# EasyEDA Pro project GIM8108-8伺泰威无刷电机.epro, schematic Schematic1
Board Name: Board1; Create Date: 2025-12-02; Page Name: P1; Project Name: FOC第三版-大电流; Schematic Name: Schematic1; Update Date: 2025-12-10; BladeWidth: 10; Company: 嘉立创EDA; Page Size: A4; RegionStart: 1; ShowBorder: 1; TitleBlock: 1; TitleBlockPosition: 3; Version: V1.0; XRegionCount: 6; YRegionCount: 4
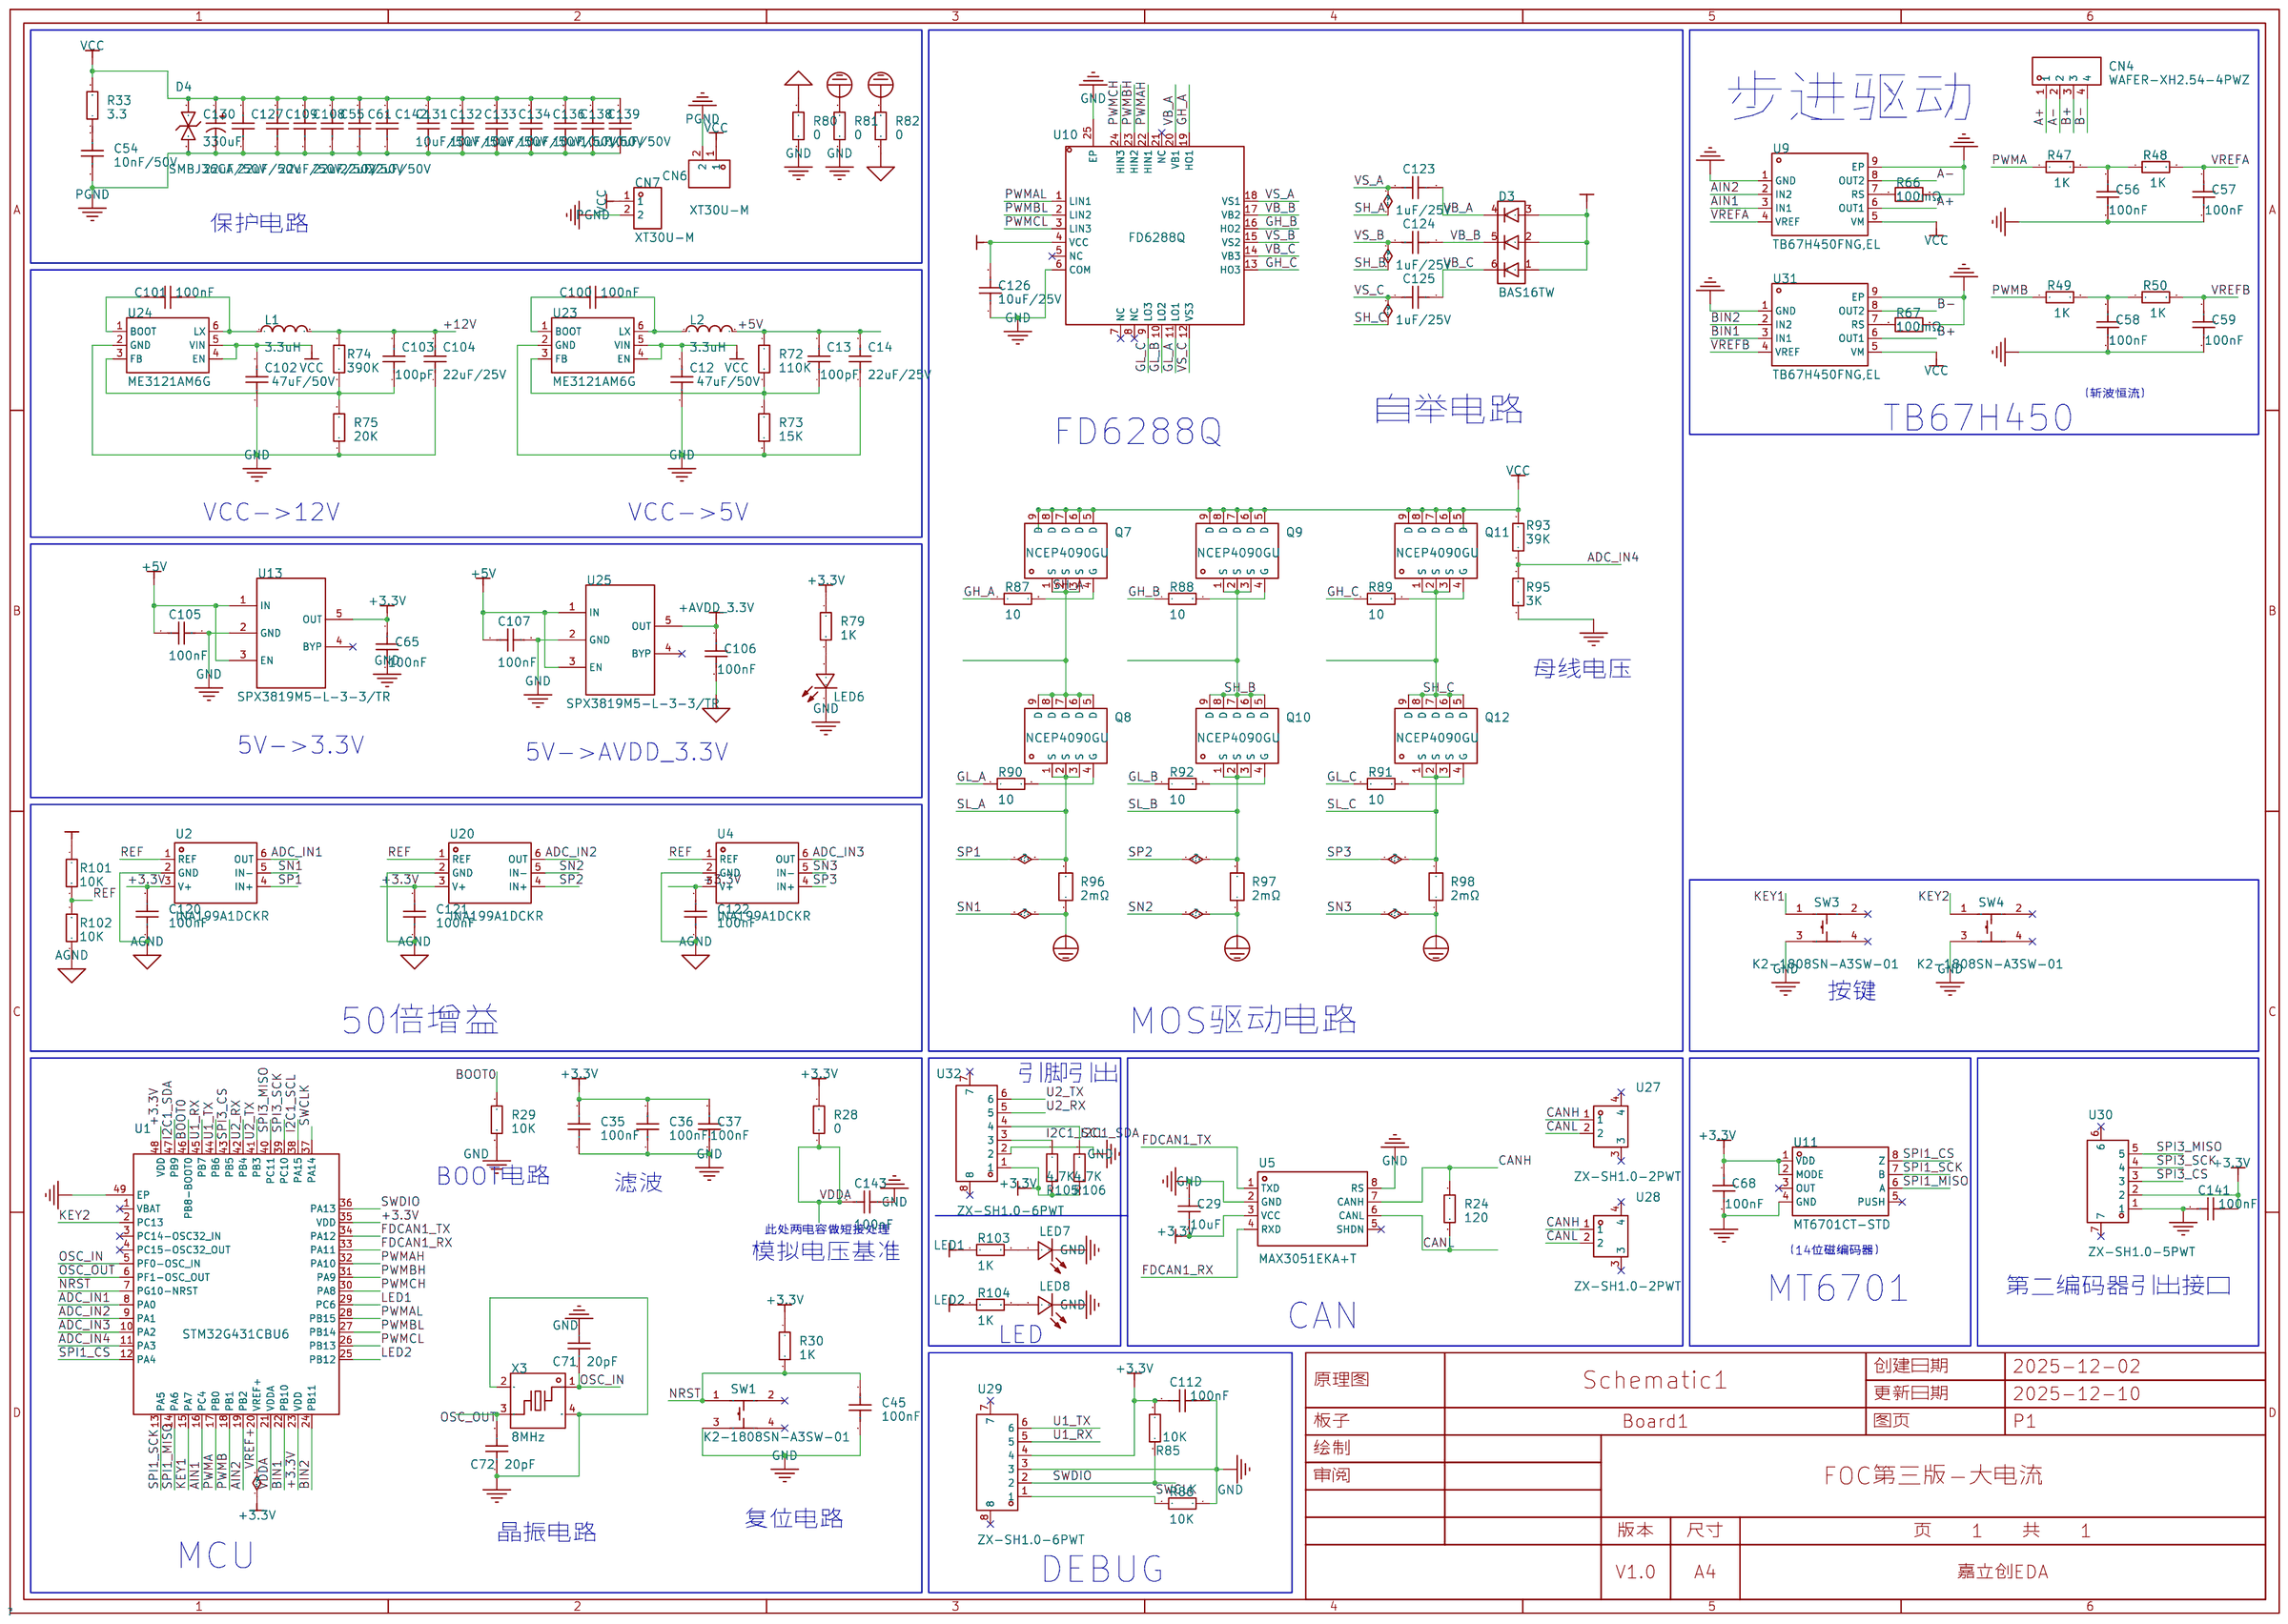
[diagram p0: schematic sheet]

## Parts
C12  47uF/50V  [C1206]
C13  100pF  [C0603]
C14  22uF/25V  [C0805]
C29  10uF  [C0603]
C35  100nF  [C0603]
C36  100nF  [C0603]
C37  100nF  [C0603]
C45  100nF  [C0603]
C54  10nF/50V  [C0603]
C55  22uF/50V  [C1206]
C56  100nF  [C0603]
C57  100nF  [C0603]
C58  100nF  [C0603]
C59  100nF  [C0603]
C61  22uF/50V  [C1206]
C65  100nF  [C0603]
C68  100nF  [C0603]
C71  20pF  [C0603]
C72  20pF  [C0603]
C100  100nF  [C0603]
C101  100nF  [C0603]
C102  47uF/50V  [C1206]
C103  100pF  [C0603]
C104  22uF/25V  [C0805]
C105  100nF  [C0603]
C106  100nF  [C0603]
C107  100nF  [C0603]
C108  22uF/50V  [C1206]
C109  22uF/50V  [C1206]
C112  100nF  [C0603]
C120  100nF  [C0603]
C121  100nF  [C0603]
C122  100nF  [C0603]
C123  1uF/25V  [C0603]
C124  1uF/25V  [C0603]
C125  1uF/25V  [C0603]
C126  10uF/25V  [C0603]
C127  22uF/50V  [C1206]
C130  330uF  [CAP-SMD_BD10.0-L10.3-W10.3-FD-LS11.0]
C131  10uF/50V  [C0805]
C132  10uF/50V  [C0805]
C133  10uF/50V  [C0805]
C134  10uF/50V  [C0805]
C136  10uF/50V  [C0805]
C138  10uF/50V  [C0805]
C139  10uF/50V  [C0805]
C141  100nF  [C0603]
C142  22uF/50V  [C1206]
C143  100nF  [C0603]
CN4  WAFER-XH2.54-4PWZ  [CONN-TH_4P-P2.50_WAFER-XH2.54-4PWZ]
CN6  XT30U-M  [CONN-TH_XT30U-M]
CN7  XT30U-M  [CONN-TH_XT30U-M]
D3  BAS16TW  [SOT-363_L2.1-W1.3-P0.65-LS2.3-BL]
D4  SMBJ36CA  [SMB_L4.4-W3.6-LS5.3-BI]
L1  3.3uH  [IND-SMD_L3.8-W3.8_GCRH3D16-XX]
L2  3.3uH  [IND-SMD_L3.8-W3.8_GCRH3D16-XX]
LED6  KT-0603R  [LED0603-RD]
LED7  KT-0603R  [LED0603-RD]
LED8  KT-0603R  [LED0603-RD]
Q7  NCEP4090GU  [PDFN-8_L5.8-W5.1-P1.27-LS6.1-BL]
Q8  NCEP4090GU  [PDFN-8_L5.8-W5.1-P1.27-LS6.1-BL]
Q9  NCEP4090GU  [PDFN-8_L5.8-W5.1-P1.27-LS6.1-BL]
Q10  NCEP4090GU  [PDFN-8_L5.8-W5.1-P1.27-LS6.1-BL]
Q11  NCEP4090GU  [PDFN-8_L5.8-W5.1-P1.27-LS6.1-BL]
Q12  NCEP4090GU  [PDFN-8_L5.8-W5.1-P1.27-LS6.1-BL]
R24  120  [R0603]
R28  0  [R0603]
R29  10K  [R0603]
R30  1K  [R0603]
R33  3.3  [R0603]
R47  1K  [R0603]
R48  1K  [R0603]
R49  1K  [R0603]
R50  1K  [R0603]
R66  100mΩ  [RES-SMD_L6.4-W3.2-R2512]
R67  100mΩ  [RES-SMD_L6.4-W3.2-R2512]
R72  110K  [R0603]
R73  15K  [R0603]
R74  390K  [R0603]
R75  20K  [R0603]
R79  1K  [R0603]
R80  0  [R0603]
R81  0  [R0603]
R82  0  [R0603]
R85  10K  [R0603]
R86  10K  [R0603]
R87  10  [R0603]
R88  10  [R0603]
R89  10  [R0603]
R90  10  [R0603]
R91  10  [R0603]
R92  10  [R0603]
R93  39K  [R0603]
R95  3K  [R0603]
R96  2mΩ  [R1206]
R97  2mΩ  [R1206]
R98  2mΩ  [R1206]
R101  10K  [R0603]
R102  10K  [R0603]
R103  1K  [R0603]
R104  1K  [R0603]
R105  4.7K  [R0603]
R106  4.7K  [R0603]
SW1  K2-1808SN-A3SW-01  [SW-SMD_4P-L4.2-W3.3-P2.15-LS5.1]
SW3  K2-1808SN-A3SW-01  [SW-SMD_4P-L4.2-W3.3-P2.15-LS5.1]
SW4  K2-1808SN-A3SW-01  [SW-SMD_4P-L4.2-W3.3-P2.15-LS5.1]
U1  STM32G431CBU6  [VQFN-48_L7.0-W7.0-P0.50-BL-EP5.5]
U2  INA199A1DCKR  [SC-70-6_L2.2-W1.3-P0.65-LS2.1-BR]
U4  INA199A1DCKR  [SC-70-6_L2.2-W1.3-P0.65-LS2.1-BR]
U5  MAX3051EKA+T  [SOT-23-8_L3.0-W1.7-P0.65-LS2.8-TL]
U9  TB67H450FNG,EL  [HSOP-8_L5.0-W4.0-P1.27-LS6.2-BL-EP]
U10  FD6288Q  [QFN-24_L4.0-W4.0-P0.50-BL-EP2.6]
U11  MT6701CT-STD  [SOP-8_L4.9-W3.9-P1.27-LS6.0-BL]
U13  SPX3819M5-L-3-3/TR  [SOT-23-5_L3.0-W1.7-P0.95-LS2.8-BL]
U20  INA199A1DCKR  [SC-70-6_L2.2-W1.3-P0.65-LS2.1-BR]
U23  ME3121AM6G  [SOT-23-6_L2.9-W1.6-P0.95-LS2.8-BR]
U24  ME3121AM6G  [SOT-23-6_L2.9-W1.6-P0.95-LS2.8-BR]
U25  SPX3819M5-L-3-3/TR  [SOT-23-5_L3.0-W1.7-P0.95-LS2.8-BL]
U27  ZX-SH1.0-2PWT  [CONN-SMD_2P-P1.00_HX-1.0-2P-WT]
U28  ZX-SH1.0-2PWT  [CONN-SMD_2P-P1.00_HX-1.0-2P-WT]
U29  ZX-SH1.0-6PWT  [CONN-SMD_6P-P1.00_MEGASTAR_ZX-SH1.0-6PWT]
U30  ZX-SH1.0-5PWT  [CONN-SMD_5P-P1.00_MEGASTAR_ZX-SH1.0-5PWT]
U31  TB67H450FNG,EL  [HSOP-8_L5.0-W4.0-P1.27-LS6.2-BL-EP]
U32  ZX-SH1.0-6PWT  [CONN-SMD_6P-P1.00_MEGASTAR_ZX-SH1.0-6PWT]
X3  8MHz  [CRYSTAL-SMD_4P-L3.2-W2.5-BL]

## Library data of the parts
C12 C55 C61 C102 C108 C109 C127 C142 = CAP_1206: Supplier Footprint: 1206
C13 C29 C35-C37 C45 C54 C56-C59 C65 C68 C71 C72 C100 C101 C103 C105-C107 C112 C120-C126 C141 C143 = CAP_0603: Supplier Footprint: 0603
C14 C104 C131-C134 C136 C138 C139 = CAP_0805: Supplier Footprint: 0805
C130 = JVJ50V330M10x10: 容值:330uF;精度:±20%;额定电压:50V;纹波电流:220mA@120Hz;; LCSC Part Name: 330uF ±20% 50V; Supplier Part: C46550419; Manufacturer: JIERR(捷而瑞); Supplier Footprint: SMD,D10xL10.5mm; Datasheet: https://item.szlcsc.com/datasheet/JVJ50V330M10x10/48680113.html; Supplier: LCSC; Tolerance: ±20%; Voltage Rating: 50V; Ripple Current: 220mA@120Hz; Diameter: 10mm; Height - Seated (Max): 10.5mm; Lifetime: 2000hrs@105℃; Operating Temperature: -55℃~+105℃
CN4 = WAFER-XH2.54-4PWZ: 插针结构:1x4P;间距:2.54mm;安装方式:弯插;总PIN数:4P;排数:1;每排PIN数:4;额定电流:2A;工作温度范围:-25℃~+85℃;; LCSC Part Name: XH 2.54mm 1x4P 弯插; Supplier Part: C5359641; Manufacturer: XUNPU(讯普); Supplier Footprint: 弯插,P=2.5mm; JLCPCB Part Class: 扩展库; Datasheet: https://atta.szlcsc.com/upload/public/pdf/source/20230221/397FB6E0B838EFC6EA17AAEABEF58A8D.pdf; Supplier: LCSC; Pins Structure: 1x4P; Pitch: 2.54mm; Mounting Style: 弯插; Number of Pins: 4P; Number of Rows: 1; Number of PINs Per Row: 4; Current Rating (Max): 2A; Operating Temperature Range: -25℃~+85℃
CN6 CN7 = XT30U-M: 类别:-;类型1:-;; LCSC Part Name: AMASS(艾迈斯)轻量版锂电池插头公头 XT30U-M; Supplier Part: C99101; Manufacturer: AMASS(艾迈斯); Datasheet: https://item.szlcsc.com/datasheet/XT30U-M/100314.html; Supplier: LCSC; Type: 插头; Colour: 黄色; InterfaceType: 公头
D3 = BAS16TW: 二极管配置:3个独立式;正向压降(Vf):1.25V@150mA;直流反向耐压(Vr):75V;整流电流:150mA;反向恢复时间(trr):4ns;; LCSC Part Name: 电压:75V 电流:150mA; Supplier Part: C68955; Manufacturer: CJ(江苏长电/长晶); Supplier Footprint: SOT-363; JLCPCB Part Class: 扩展库; Datasheet: https://atta.szlcsc.com/upload/public/pdf/source/20160516/1463363918721.pdf; Supplier: LCSC; Diode Configuration: 3个独立式; Forward Voltage (Vf@If): 1.25V@150mA; Reverse Voltage (Vr): 75V; Rectified Current: 150mA; Reverse Leakage Current: 1uA@75V; Reverse Recovery Time (trr): 4ns
D4 = SMBJ36CA_C726875: 极性：双向 反向截止电压(Vrwm)：36V 击穿电压：40V 最大钳位电压：58.1V; Supplier Part: C726875; Manufacturer: TWGMC(台湾迪嘉); Supplier Footprint: SMB; JLCPCB Part Class: 扩展库; Datasheet: https://atta.szlcsc.com/upload/public/pdf/source/20200901/C726811_07201DC3516E92FF13903A0BAE18F725.pdf; Supplier: LCSC
L1 L2 = YPRH3D16-3R3M: 电感值:3.3uH;精度:±20%;额定电流:1.1A;; LCSC Part Name: 3.3uH ±20%; Supplier Part: C514833; Manufacturer: YJYCOIN(益嘉源); Supplier Footprint: SMD,3.8x3.8x1.8mm; JLCPCB Part Class: 扩展库; Datasheet: https://atta.szlcsc.com/upload/public/pdf/source/20200415/C514834_534F0539B05F5AD94685E0BB7E05C791.pdf; Supplier: LCSC; Tolerance: ±20%; Rated Current: 1.1A; DC Resistance (DCR): 85mΩ
LED6-LED8 = KT-0603R: 发光颜色:红色;功率:-;正向电流:-;主波长:-;二极管配置:-;透镜颜色:-;色温:-;发光角度:-;载带方式:-;工作温度:-40℃~+85℃;; LCSC Part Name: 0603 红灯 高亮; Supplier Part: C2286; Manufacturer: KENTO; Supplier Footprint: 0603; JLCPCB Part Class: 基础库; Datasheet: https://atta.szlcsc.com/upload/public/pdf/source/20160616/1466072038404.pdf; Supplier: LCSC; Emitted Color: 红色; Operating Temperature: -40℃~+85℃
Q7-Q12 = NCEP4090GU: 类型:1个N沟道;漏源电压(Vdss):40V;连续漏极电流(Id):90A;导通电阻(RDS(on)@Vgs,Id):2.2mΩ@10V,20A;功率:34W;阈值电压(Vgs(th)@Id):1.5V@250uA;; LCSC Part Name: 1个N沟道 耐压:40V 电流:90A; Supplier Part: C502976; Manufacturer: NCE(无锡新洁能); Supplier Footprint: PDFN-8(5.1x5.8); JLCPCB Part Class: 扩展库; Datasheet: https://atta.szlcsc.com/upload/public/pdf/source/20220527/503A5DACCB80AF3F7DC57D53F14F52A5.pdf; Supplier: LCSC; Type: 1个N沟道; Drain Source Voltage (Vdss): 40V; Continuous Drain Current (Id): 90A; Drain Source On Resistance (RDS(on)@Vgs,Id): 2.2mΩ@10V,20A; Power Dissipation (Pd): 34W; Gate Threshold Voltage (Vgs(th)@Id): 1.5V@250uA; Total Gate Charge (Qg@Vgs): 40nC@20V; Input Capacitance (Ciss@Vds): 2.3nF@20V; Reverse Transfer Capacitance (Crss@Vds): 38pF; Operating Temperature: -55℃~+150℃
R24 R28-R30 R33 R47-R50 R72-R75 R79-R82 R85-R93 R95 R101-R106 = Res_0603: Supplier Footprint: 0603
R66 R67 = HoJLR2512-3W-100mR-1%: 电阻类型:采样电阻;阻值:100mΩ;精度:±1%;功率:3W;安装方式:贴片;; LCSC Part Name: 100mΩ ±1% 3W; Supplier Part: C2903476; Manufacturer: Milliohm(毫欧); Supplier Footprint: 2512; JLCPCB Part Class: 扩展库; Datasheet: https://atta.szlcsc.com/upload/public/pdf/source/20211009/7525CABAB363C979E942C1DD41F1FEF0.pdf; Supplier: LCSC; Type: 采样电阻; Tolerance: ±1%; Power(Watts): 3W; Mounting Sytle: 贴片
R96-R98 = HoJLR1206-1W-2mR-1%: 电阻类型:采样电阻;阻值:2mΩ;精度:±1%;功率:1W;安装方式:贴片;; LCSC Part Name: 2mΩ ±1% 1W; Supplier Part: C2904210; Manufacturer: Milliohm(毫欧); Supplier Footprint: 1206; JLCPCB Part Class: 扩展库; Datasheet: https://atta.szlcsc.com/upload/public/pdf/source/20211122/59F6674D1588D46FBBACD90BE2B15C8F.pdf; Supplier: LCSC; Type: 采样电阻; Tolerance: ±1%; Power(Watts): 1W; Mounting Type: 贴片
SW1 SW3 SW4 = K2-1808SN-A3SW-01: 触点电流:50mA;额定电压(DC):12V;绝缘电阻:100MΩ;安装方式:立贴;作用力:180gf@±30gf;机械寿命:100000;工作温度:-25℃~+85℃;开关长度:4.2mm;开关宽度:3.25mm;开关高度:2.5mm;; LCSC Part Name: 3*4*2.5 贴片开关180G; Supplier Part: C2690012; Manufacturer: 韩国韩荣; Supplier Footprint: SMD; JLCPCB Part Class: 扩展库; Datasheet: https://atta.szlcsc.com/upload/public/pdf/source/20180927/C283535_7E7907F3E7B6C1691E1DC87E363D082A.pdf; Supplier: LCSC; Contact Current: 50mA; Voltage Rating (DC): 12V; Insulation Resistance: 100MΩ; Mounting Sytle: 立贴; Operating Force: 180gf@±30gf; Mechanical Life: 100000; Operating Temperature: -25℃~+85℃; Switch Length: 4.2mm; Switch Width: 3.25mm; Switch Height: 2.5mm
U1 = STM32G431CBU6: CPU内核:ARM-M系列;CPU最大主频:170MHz;应用领域:-;; LCSC Part Name: 带DSP和FPU的170MHz主流ARM Cortex-M4 MCU，具有128 KB Flash存储器、数学加速器和中等模拟电平集成; Supplier Part: C529356; Manufacturer: ST(意法半导体); Supplier Footprint: UFQFPN-48(7x7); JLCPCB Part Class: 扩展库; Datasheet: https://atta.szlcsc.com/upload/public/pdf/source/20200511/C529354_7C66CF00837B904D0C15DCE45B69418C.pdf; Supplier: LCSC; CPU Core: ARM-M系列; CPU Maximum Speed: 170MHz; Program Storage Size: 128KB; Program Memory Type: FLASH; Number of I/O: 42; ADC (Bit): 12bit; DAC (Bit): 12bit; Low Voltage Detection Threshold: 1.71V~3.6V
U2 U4 U20 = INA199A1DCKR: INA199 26V、双向电流感应放大器; Supplier Part: C59135; Manufacturer: TI(德州仪器); Supplier Footprint: SOT-363(SC-70-6); JLCPCB Part Class: 扩展库; Datasheet: https://www.ti.com/cn/lit/gpn/ina199; Supplier: LCSC; Supply Voltage: -300mV~26V; Supply Current: 300uA; Operating Temperature: -40℃~+125℃
U5 = MAX3051EKA+T: 类型:收发器;数据速率:1Mbps;; LCSC Part Name: 1Mbps 3.14V~3.47V; Supplier Part: C112005; Manufacturer: ADI(亚德诺); Supplier Footprint: SOT-23-8; JLCPCB Part Class: 扩展库; Datasheet: https://atta.szlcsc.com/upload/public/pdf/source/20171014/C112005_15079752662991037925.pdf; Supplier: LCSC; Type: 收发器; Data Rate: 1Mbps; Supply Voltage: 3.14V~3.47V
U9 U31 = TB67H450FNG,EL: Supplier Part: C545417; Manufacturer: TOSHIBA(东芝); Supplier Footprint: SOIC-8; JLCPCB Part Class: 扩展库; Datasheet: https://atta.szlcsc.com/upload/public/pdf/source/20211227/C3DC112555A020FEF41243C8668D1DC3.pdf; Supplier: LCSC
U10 = FD6288Q: Supplier Part: C328453; Manufacturer: Fortior Tech(峰岹); Supplier Footprint: QFN-24-EP(4x4); JLCPCB Part Class: 扩展库; Datasheet: https://atta.szlcsc.com/upload/public/pdf/source/20241101/0E2856EB301EAFFED732065FB088D773.pdf; Supplier: LCSC
U11 = MT6701CT-STD_C5451785: Supplier Part: C5451785; Manufacturer: MagnTek(麦歌恩); Supplier Footprint: SOP-8; JLCPCB Part Class: 扩展库; Datasheet: https://atta.szlcsc.com/upload/public/pdf/source/20240409/995E18415A669787D9A549675AADF1FD.pdf; Supplier: LCSC
U13 U25 = SPX3819M5-L-3-3/TR: 输出类型:固定;最大输入电压:16V;输出电压:3.3V;最大输出电流:500mA;电源纹波抑制比(PSRR):70dB;输出极性:正极;; LCSC Part Name: 输入16V 输出3.3V 500mA; Supplier Part: C9055; Manufacturer: MaxLinear(迈凌); Supplier Footprint: SOT-23-5; JLCPCB Part Class: 扩展库; Datasheet: https://atta.szlcsc.com/upload/public/pdf/source/20150720/1457707331934.pdf; Supplier: LCSC; Output Type: 固定; Maximum Input Voltage: 16V; Output Voltage: 3.3V; MAX Output Current: 500mA; Power Supply Rejection Ratio (PSRR): 70dB; Dropout Voltage: 700mV@(500mA); standby current: 8uA; Operating Temperature: -40℃~+125℃; Output Polarity: 正极; Number of Outputs: 1
U23 U24 = ME3121AM6G: 功能类型:降压型;输出类型:可调;工作电压:4.7V~40V;输出电压:-;输出电流:-;; LCSC Part Name: 40V输入1A负载同步整流降压DC-DC转换器; Supplier Part: C2932938; Manufacturer: MICRONE(南京微盟); Supplier Footprint: SOT-23-6; JLCPCB Part Class: 扩展库; Datasheet: https://atta.szlcsc.com/upload/public/pdf/source/20220331/EB46EBF6ED46F90696A7B4CB82ED1A1E.pdf; Supplier: LCSC; Function: 降压型; Output Type: 可调; Voltage - Supply: 4.7V~40V; Frequency - Switching: 1MHz; Operating Temperature: -40℃~+85℃; Synchronous Rectifier: 是; Number of Outputs: 1; Topology: 降压式; Quiescent Current: 120uA; Switch tube (built-in/external): 内置
U27 U28 = ZX-SH1.0-2PWT: 插针结构:1x2P;间距:1mm;安装方式:卧贴;参考系列:SH;总PIN数:2P;排数:1;每排PIN数:2;行距:-;额定电流:1A;触头材质:黄铜;触头镀层:锡;工作温度:-;; LCSC Part Name: 1x2P 间距:1mm 卧贴 系列:SH; Supplier Part: C7430444; Manufacturer: Megastar(兆星); Supplier Footprint: SMD,P=1mm,卧贴; JLCPCB Part Class: 扩展库; Datasheet: https://item.szlcsc.com/datasheet/ZX-SH1.0-2PWT/8430313.html; Supplier: LCSC; Pins Structure: 1x2P; Pitch: 1mm; Mounting Type: 卧贴; Reference Series: SH; Number of Pins: 2P; Number of Rows: 1; Number of PINs Per Row: 2; Current Rating: 1A; Contact Material: 黄铜; Contact Plating: 锡; Supplementary Features: 辅助焊脚; Color: 米色; Z-Height of the Board: 3.15mm; X-Length of Bottom Edge on Board (Spacing Line): 4.35mm; Y-Width of Bottom Edge on Board: 5.05mm
U29 U32 = ZX-SH1.0-6PWT: 插针结构:1x6P;间距:1mm;安装方式:卧贴;参考系列:SH;总PIN数:6P;排数:1;每排PIN数:6;行距:-;额定电流:1A;触头材质:黄铜;触头镀层:锡;工作温度:-;; LCSC Part Name: 1x6P 间距:1mm 卧贴 系列:SH; Supplier Part: C7430448; Manufacturer: Megastar(兆星); Supplier Footprint: SMD,P=1mm,卧贴; JLCPCB Part Class: 扩展库; Datasheet: https://item.szlcsc.com/datasheet/ZX-SH1.0-6PWT/8430317.html; Supplier: LCSC; Pins Structure: 1x6P; Pitch: 1mm; Mounting Type: 卧贴; Reference Series: SH; Number of Pins: 6P; Number of Rows: 1; Number of PINs Per Row: 6; Current Rating: 1A; Contact Material: 黄铜; Contact Plating: 锡; Supplementary Features: 辅助焊脚; Color: 米色; Z-Height of the Board: 3.15mm; X-Length of Bottom Edge on Board (Spacing Line): 8.35mm; Y-Width of Bottom Edge on Board: 5.05mm
U30 = ZX-SH1.0-5PWT: 插针结构:1x5P;间距:1mm;安装方式:卧贴;参考系列:SH;总PIN数:5P;排数:1;每排PIN数:5;行距:-;额定电流:1A;触头材质:黄铜;触头镀层:锡;工作温度:-;; LCSC Part Name: 1x5P 间距:1mm 卧贴 系列:SH; Supplier Part: C7430447; Manufacturer: Megastar(兆星); Supplier Footprint: SMD,P=1mm,卧贴; JLCPCB Part Class: 扩展库; Datasheet: https://item.szlcsc.com/datasheet/ZX-SH1.0-5PWT/8430316.html; Supplier: LCSC; Pins Structure: 1x5P; Pitch: 1mm; Mounting Type: 卧贴; Reference Series: SH; Number of Pins: 5P; Number of Rows: 1; Number of PINs Per Row: 5; Current Rating: 1A; Contact Material: 黄铜; Contact Plating: 锡; Supplementary Features: 辅助焊脚; Color: 米色; Z-Height of the Board: 3.15mm; X-Length of Bottom Edge on Board (Spacing Line): 7.35mm; Y-Width of Bottom Edge on Board: 5.05mm
X3 = X32258MSB4SI: 晶振类型:贴片晶振;频率:8MHz;常温频差:±10ppm;外接负载电容:20pF;频率稳定度(全温):±20ppm;; LCSC Part Name: 8MHz ±10ppm 20pF; Supplier Part: C2682774; Manufacturer: YXC(扬兴晶振); Supplier Footprint: SMD3225-4P; JLCPCB Part Class: 扩展库; Datasheet: https://atta.szlcsc.com/upload/public/pdf/source/20240329/19D5F850207469550BEB00D7DFEDBC7A.pdf; Supplier: LCSC; Crystal Type: 贴片晶振; Normal temperature Frequency Tolerance: ±10ppm; External load capacitor: 20pF; Frequency Stability(Full temperature range): ±20ppm; Operating Temperature: -40℃~+85℃

## Nets
+3.3V: C29.2 C35.2 C36.2 C37.2 C65.1 C68.1 C112.2 C120.2 C121.2 C122.2 C141.1 R28.2 R30.1 R79.1 R85.2 R105.1 R106.1 U1.20(VREF+) U1.23(VDD) U1.35(VDD) U1.48(VDD) U2.3(V+) U4.3(V+) U5.3(VCC) U11.1(VDD) U11.2(MODE) U13.5(OUT) U20.3(V+) U29.4 U30.2 U32.1
+5V: C13.2 C14.2 C105.1 C107.1 L2.2 R72.1 U13.1(IN) U13.3(EN) U25.1(IN) U25.3(EN)
+12V: C103.2 C104.2 C126.2 D3.1(A) D3.2(A) D3.3(A) L1.2 R74.1 U10.4(VCC)
+AVDD_3.3V: C106.1 R101.1 U25.5(OUT)
AGND: C106.2 C120.1 C121.1 C122.1 R80.2 R82.1 R102.2 U2.2(GND) U4.2(GND) U20.2(GND)
GND: C12.1 C14.1 C29.1 C35.1 C36.1 C37.1 C45.2 C56.2 C57.2 C58.2 C59.2 C65.2 C68.2 C71.1 C72.1 C102.1 C104.1 C105.2 C107.2 C112.1 C126.1 C141.2 C143.1 LED6.1(K) LED7.1(K) LED8.1(K) R29.2 R66.2 R67.2 R73.1 R75.1 R80.1 R81.1 R86.1 R95.1 SW1.3 SW3.3 SW4.3 U1.49(EP) U5.2(GND) U5.8(RS) U9.1(GND) U9.9(EP) U10.6(COM) U10.25(EP) U11.4(GND) U13.2(GND) U23.2(GND) U24.2(GND) U25.2(GND) U29.3 U30.1 U31.1(GND) U31.9(EP) U32.2 X3.2(GND) X3.4(GND)
PGND: C54.2 C55.1 C61.1 C108.1 C109.1 C127.1 C130.2 C131.1 C132.1 C133.1 C134.1 C136.1 C138.1 C139.1 C142.1 CN6.2 CN7.2 D4.2 R81.2 R82.2 R96.1 R97.1 R98.1 U2.5(IN-) U4.5(IN-) U20.5(IN-)
VCC: C12.2 C55.2 C61.2 C102.2 C108.2 C109.2 C127.2 C130.1 C131.2 C132.2 C133.2 C134.2 C136.2 C138.2 C139.2 C142.2 CN6.1 CN7.1 D4.1 Q7.5(D) Q7.6(D) Q7.7(D) Q7.8(D) Q7.9(D) Q9.5(D) Q9.6(D) Q9.7(D) Q9.8(D) Q9.9(D) Q11.5(D) Q11.6(D) Q11.7(D) Q11.8(D) Q11.9(D) R33.2 R93.2 U9.5(VM) U23.4(EN) U23.5(VIN) U24.4(EN) U24.5(VIN) U31.5(VM)
VDDA: C143.2 R28.1 U1.21(VDDA)
A+: CN4.1 U9.6(OUT1)
A-: CN4.2 U9.8(OUT2)
ADC_IN1: U1.8(PA0) U2.6(OUT)
ADC_IN2: U1.9(PA1) U20.6(OUT)
ADC_IN3: U1.10(PA2) U4.6(OUT)
ADC_IN4: R93.1 R95.2 U1.11(PA3)
AIN1: U1.16(PC4) U9.3(IN1)
AIN2: U1.19(PB2) U9.2(IN2)
B+: CN4.3 U31.6(OUT1)
B-: CN4.4 U31.8(OUT2)
BIN1: U1.22(PB10) U31.3(IN1)
BIN2: U1.24(PB11) U31.2(IN2)
BOOT0: R29.1 U1.46(PB8-BOOT0)
CANH: R24.1 U5.7(CANH) U27.1 U28.1
CANL: R24.2 U5.6(CANL) U27.2 U28.2
FDCAN1_RX: U1.33(PA11) U5.4(RXD)
FDCAN1_TX: U1.34(PA12) U5.1(TXD)
GH_A: R87.1 U10.19(HO1)
GH_B: R88.1 U10.16(HO2)
GH_C: R89.1 U10.13(HO3)
GL_A: R90.1 U10.11(LO1)
GL_B: R92.1 U10.10(LO2)
GL_C: R91.1 U10.9(LO3)
I2C1_SCL: R105.2 U1.38(PA15) U32.3
I2C1_SDA: R106.2 U1.47(PB9) U32.4
KEY1: SW3.1 U1.15(PA7)
KEY2: SW4.1 U1.2(PC13)
LED1: R103.1 U1.29(PC6)
LED2: R104.1 U1.25(PB12)
NRST: C45.1 R30.2 SW1.1 U1.7(PG10-NRST)
OSC_IN: C71.2 U1.5(PF0-OSC_IN) X3.1
OSC_OUT: C72.2 U1.6(PF1-OSC_OUT) X3.3
PWMA: R47.1 U1.17(PB0)
PWMAH: U1.32(PA10) U10.22(HIN1)
PWMAL: U1.28(PB15) U10.1(LIN1)
PWMB: R49.1 U1.18(PB1)
PWMBH: U1.31(PA9) U10.23(HIN2)
PWMBL: U1.27(PB14) U10.2(LIN2)
PWMCH: U1.30(PA8) U10.24(HIN3)
PWMCL: U1.26(PB13) U10.3(LIN3)
REF: R101.2 R102.1 U2.1(REF) U4.1(REF) U20.1(REF)
SH_A: C123.1 Q7.1(S) Q7.2(S) Q7.3(S) Q8.5(D) Q8.6(D) Q8.7(D) Q8.8(D) Q8.9(D) U10.18(VS1)
SH_B: C124.1 Q9.1(S) Q9.2(S) Q9.3(S) Q10.5(D) Q10.6(D) Q10.7(D) Q10.8(D) Q10.9(D) U10.15(VS2)
SH_C: C125.1 Q11.1(S) Q11.2(S) Q11.3(S) Q12.5(D) Q12.6(D) Q12.7(D) Q12.8(D) Q12.9(D) U10.12(VS3)
SL_A: Q8.1(S) Q8.2(S) Q8.3(S) R96.2 U2.4(IN+)
SL_B: Q10.1(S) Q10.2(S) Q10.3(S) R97.2 U20.4(IN+)
SL_C: Q12.1(S) Q12.2(S) Q12.3(S) R98.2 U4.4(IN+)
SPI1_CS: U1.12(PA4) U11.8(Z)
SPI1_MISO: U1.14(PA6) U11.6(A)
SPI1_SCK: U1.13(PA5) U11.7(B)
SPI3_CS: U1.43(PB5) U30.3
SPI3_MISO: U1.40(PC11) U30.5
SPI3_SCK: U1.39(PC10) U30.4
SWCLK: R86.2 U1.37(PA14) U29.1
SWDIO: R85.1 U1.36(PA13) U29.2
U1_RX: U1.45(PB7) U29.5
U1_TX: U1.44(PB6) U29.6
U2_RX: U1.42(PB4) U32.5
U2_TX: U1.41(PB3) U32.6
VB_A: C123.2 D3.4(K) U10.20(VB1)
VB_B: C124.2 D3.5(K) U10.17(VB2)
VB_C: C125.2 D3.6(K) U10.14(VB3)
VREFA: C57.1 R48.2 U9.4(VREF)
VREFB: C59.1 R50.2 U31.4(VREF)
$1N11598: Q12.4(G) R91.2
$1N11606: Q10.4(G) R92.2
$1N11613: Q11.4(G) R89.2
$1N11614: Q9.4(G) R88.2
$1N11628: Q8.4(G) R90.2
$1N11631: Q7.4(G) R87.2
$1N16072: C100.2 L2.1 U23.6(LX)
$1N16076: C13.1 R72.2 R73.2 U23.3(FB)
$1N16077: C100.1 U23.1(BOOT)
$1N16078: C103.1 R74.2 R75.2 U24.3(FB)
$1N16082: C101.2 L1.1 U24.6(LX)
$1N16101: C54.1 R33.1
$1N16132: C101.1 U24.1(BOOT)
$1N16186: LED6.2(A) R79.2
$1N16211: LED7.2(A) R103.2
$1N21374: C58.1 R49.2 R50.1
$1N21388: R66.1 U9.7(RS)
$1N21393: R67.1 U31.7(RS)
$1N21396: C56.1 R47.2 R48.1
$1N21588: LED8.2(A) R104.2

Not connected (* = marked no-connect by the designer): SW1 2* 4*; SW3 2* 4*; SW4 2* 4*; U1 1(VBAT)* 3(PC14-OSC32_IN)* 4(PC15-OSC32_OUT)*; U5 5(SHDN)*; U10 5(NC)* 7(NC)* 8(NC)* 21(NC)*; U11 3(OUT)* 5(PUSH)*; U13 4(BYP)*; U25 4(BYP)*; U27 3* 4*; U28 3* 4*; U29 7* 8*; U30 6* 7*; U32 7* 8*

## Notes on the sheet
- 步进驱动
- 保护电路
- （斩波恒流）
- 自举电路
- TB67H450
- FD6288Q
- VCC->12V
- VCC->5V
- 母线电压
- 5V->3.3V
- 5V->AVDD_3.3V
- 按键
- 50倍增益
- MOS驱动电路
- 引脚引出
- BOOT电路
- 滤波
- 此处两电容做短接处理
- 模拟电压基准
- （14位磁编码器）
- MT6701
- 第二编码器引出接口
- CAN
- LED
- 复位电路
- 晶振电路
- MCU
- DEBUG
